# Altium schematic sheet 16_FPC_Connector_Debug.SchDoc: FPC Debug Connector
size 420 x 297 mm; CheckedBy: TBD; Author: Lukas Henkel; DocumentNumber: 16; SheetNumber: 16; SheetTotal: 16; DocSize: A3
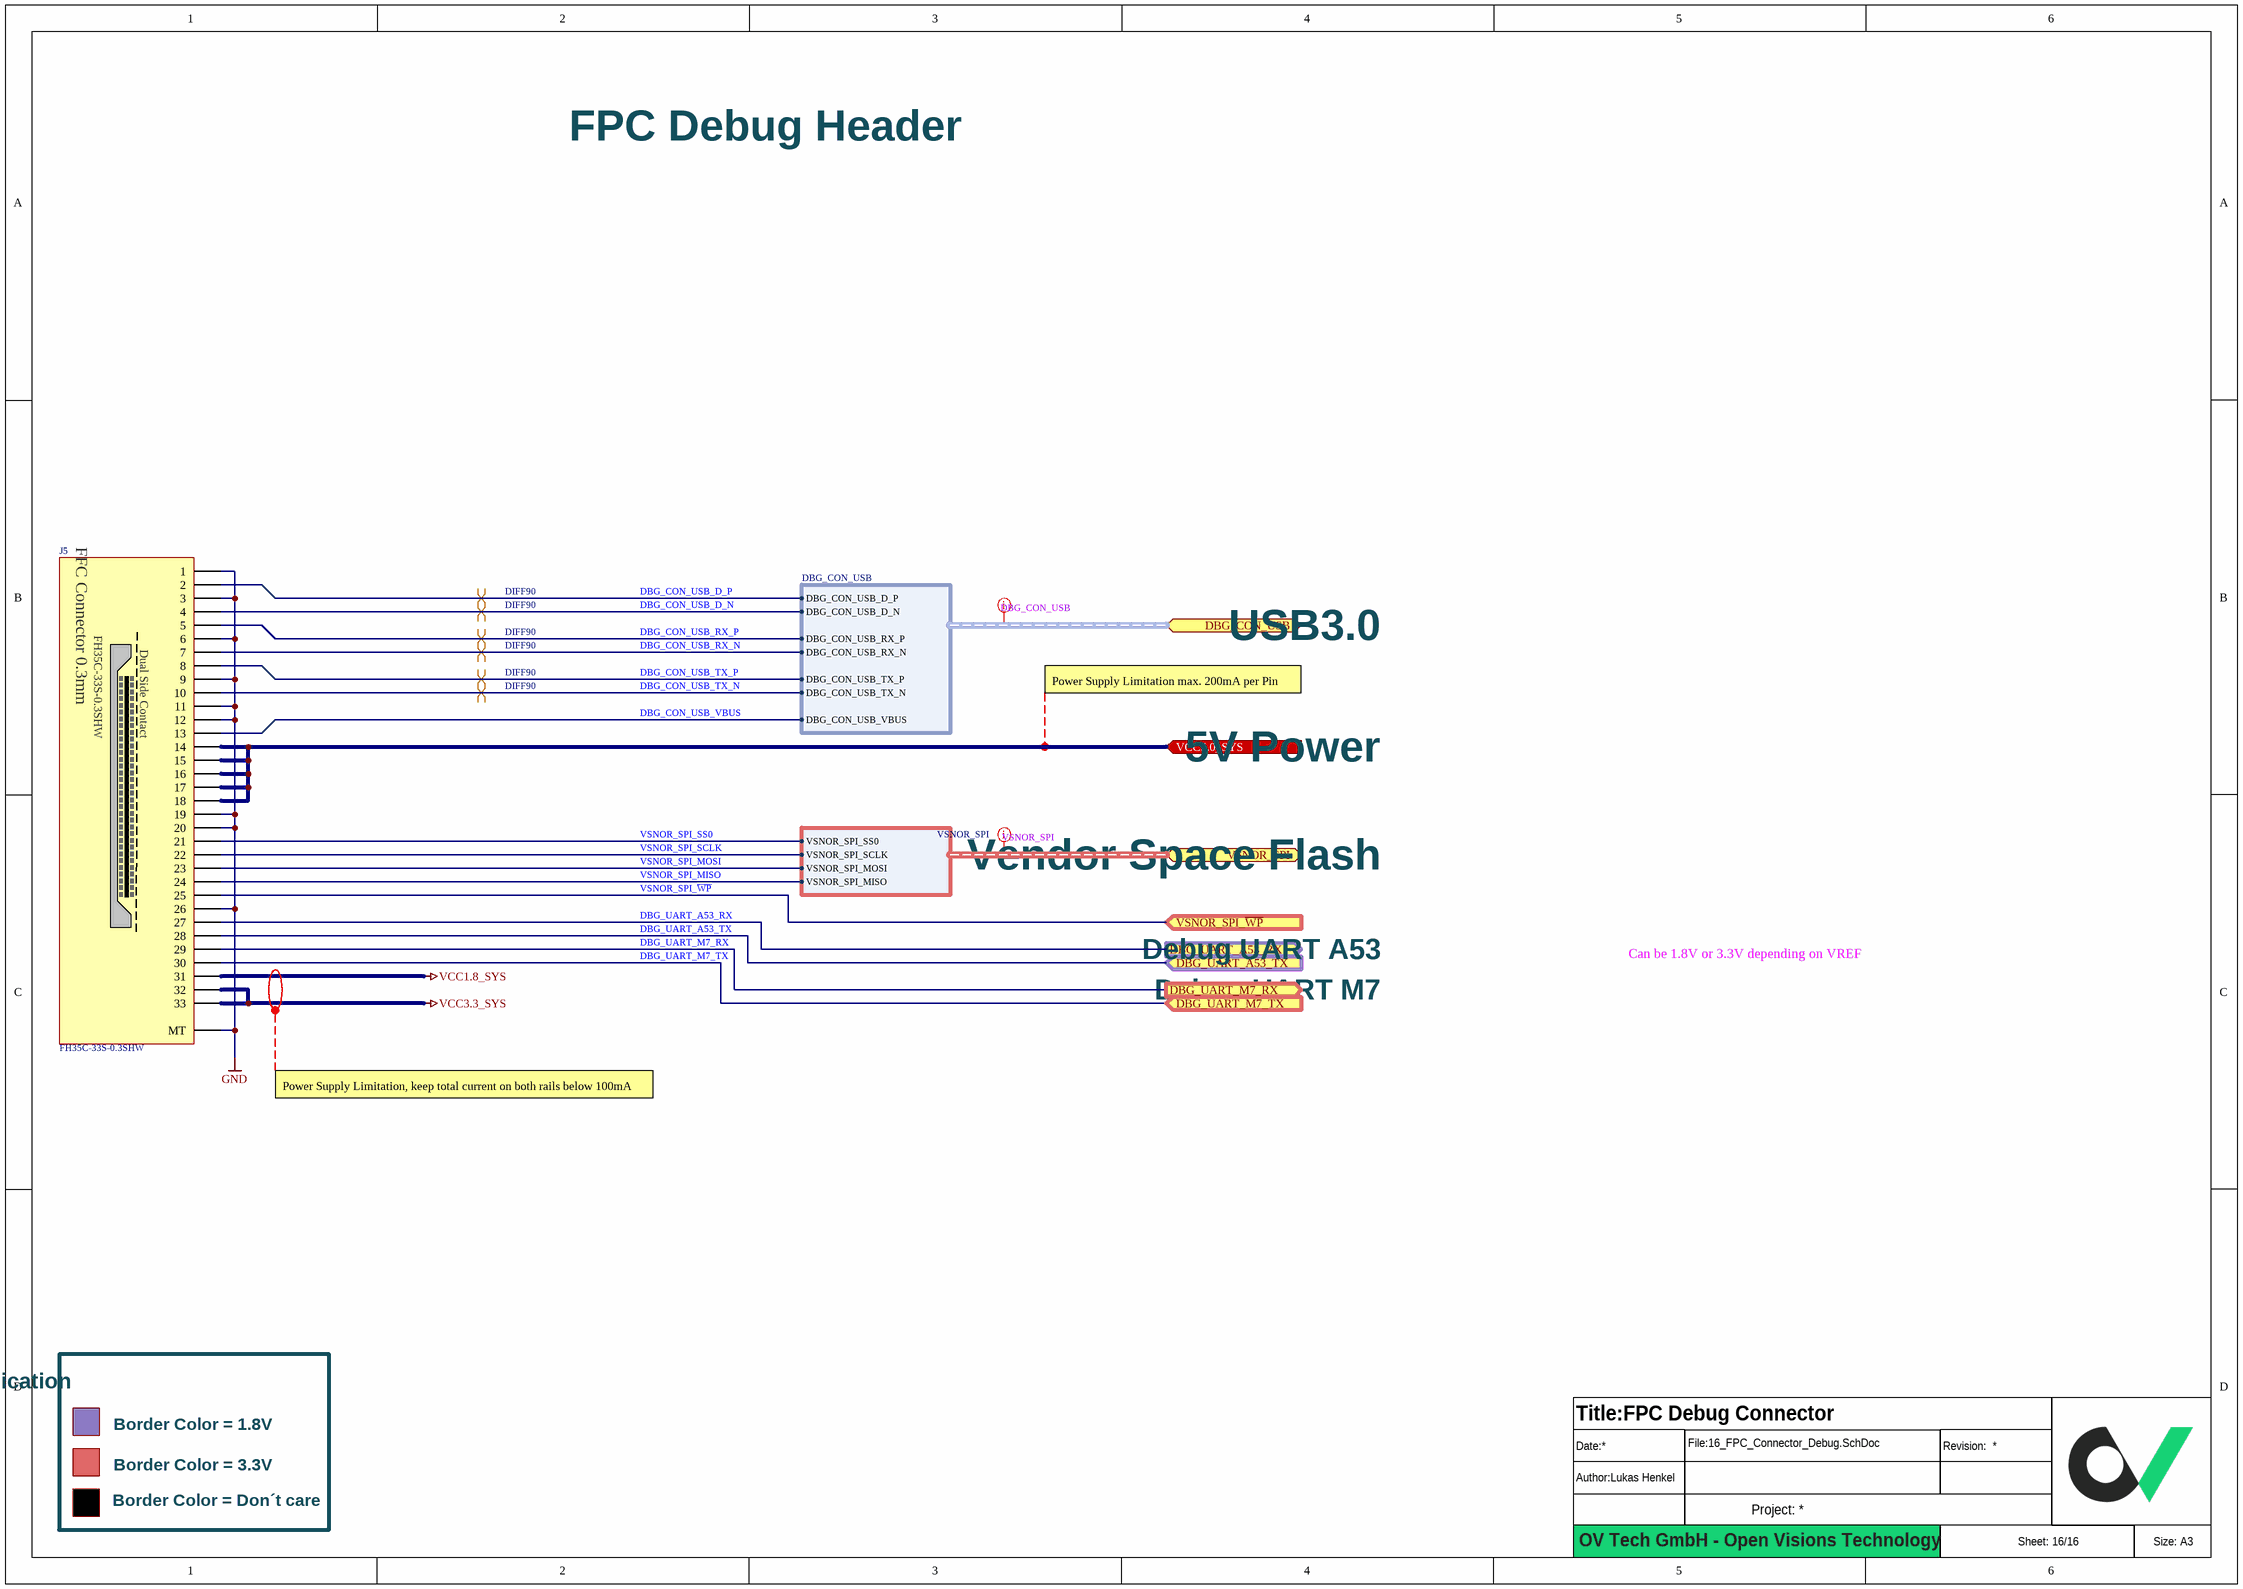
[diagram p0: 16_FPC_Connector_Debug.SchDoc]

## Parts
?  (no value)  (graphical)
J5  FH35C-33S-0.3SHW  [FFC 33pol 0.3mm FH35C-33S-0.3SHW]

## Ports
DBG_CON_USB (bidir, harness DBG_CON_USB), DBG_UART_A53_RX (out), DBG_UART_A53_TX (in), DBG_UART_M7_RX (out), DBG_UART_M7_TX (in), VCC5.0_SYS (in), VSNOR_SPI (bidir, harness VSNOR_SPI), VSNOR_SPI_~{WP} (in)

## Harnesses
DBG_CON_USB: DBG_CON_USB_VBUS, DBG_CON_USB_D_N, DBG_CON_USB_D_P, DBG_CON_USB_RX_N, DBG_CON_USB_RX_P, DBG_CON_USB_TX_N, DBG_CON_USB_TX_P
VSNOR_SPI: VSNOR_SPI_SS0, VSNOR_SPI_SCLK, VSNOR_SPI_MOSI, VSNOR_SPI_MISO

## Nets
GND: J5.1 J5.3 J5.6 J5.9 J5.11 J5.12 J5.19 J5.20 J5.26 J5.MT
VCC1.8_SYS: J5.31
VCC3.3_SYS: J5.32 J5.33
DBG_CON_USB_D_N: J5.4 ; port DBG_CON_USB.DBG_CON_USB_D_N
DBG_CON_USB_D_P: J5.2 ; port DBG_CON_USB.DBG_CON_USB_D_P
DBG_CON_USB_RX_N: J5.7 ; port DBG_CON_USB.DBG_CON_USB_RX_N
DBG_CON_USB_RX_P: J5.5 ; port DBG_CON_USB.DBG_CON_USB_RX_P
DBG_CON_USB_TX_N: J5.10 ; port DBG_CON_USB.DBG_CON_USB_TX_N
DBG_CON_USB_TX_P: J5.8 ; port DBG_CON_USB.DBG_CON_USB_TX_P
DBG_CON_USB_VBUS: J5.13 ; port DBG_CON_USB.DBG_CON_USB_VBUS
DBG_UART_A53_RX: J5.27 ; port DBG_UART_A53_RX
DBG_UART_A53_TX: J5.28 ; port DBG_UART_A53_TX
DBG_UART_M7_RX: J5.29 ; port DBG_UART_M7_RX
DBG_UART_M7_TX: J5.30 ; port DBG_UART_M7_TX
VCC5.0_SYS: J5.14 J5.15 J5.16 J5.17 J5.18 ; port VCC5.0_SYS
VSNOR_SPI_MISO: J5.24 ; port VSNOR_SPI.VSNOR_SPI_MISO
VSNOR_SPI_MOSI: J5.23 ; port VSNOR_SPI.VSNOR_SPI_MOSI
VSNOR_SPI_SCLK: J5.22 ; port VSNOR_SPI.VSNOR_SPI_SCLK
VSNOR_SPI_SS0: J5.21 ; port VSNOR_SPI.VSNOR_SPI_SS0
VSNOR_SPI_~{WP}: J5.25 ; port VSNOR_SPI_~{WP}

## Layout directives
net class DBG_CON_USB: (no net found under the mark)
differential pair; differential pair class DIFF90: DBG_CON_USB_D_N, DBG_CON_USB_D_P, DBG_CON_USB_RX_N, DBG_CON_USB_RX_P, DBG_CON_USB_TX_N, DBG_CON_USB_TX_P
net class VSNOR_SPI: (no net found under the mark)

## Notes on the sheet
- FPC Debug Header
- USB3.0
- Power Supply Limitation max. 200mA per Pin
- 5V Power
- Vendor Space Flash
- Debug UART A53
- Debug UART M7
- Can be 1.8V or 3.3V depending on VREF
- Power Supply Limitation, keep total current on both rails below 100mA
- Signal Level Indication
- Border Color = 1.8V
- Border Color = 3.3V
- Border Color = Don´t care
- OV Tech GmbH - Open Visions Technology
- (in symbol FFC Connector_33pol_FH35C-33S-0.3SHW) FFC Connector 0.3mm; Dual Side Contact

## Library data of the parts
? = Titleblock_01_OpenSource
J5 = FFC Connector_33pol_FH35C-33S-0.3SHW: FFC Connector 33pol 0.3mm Pitch Double Sided Contacts; Manufacturer 1: Hirose Connector; Manufacturer 1 Prt. Nr.: FH35C-33S-0.3SHW(99)